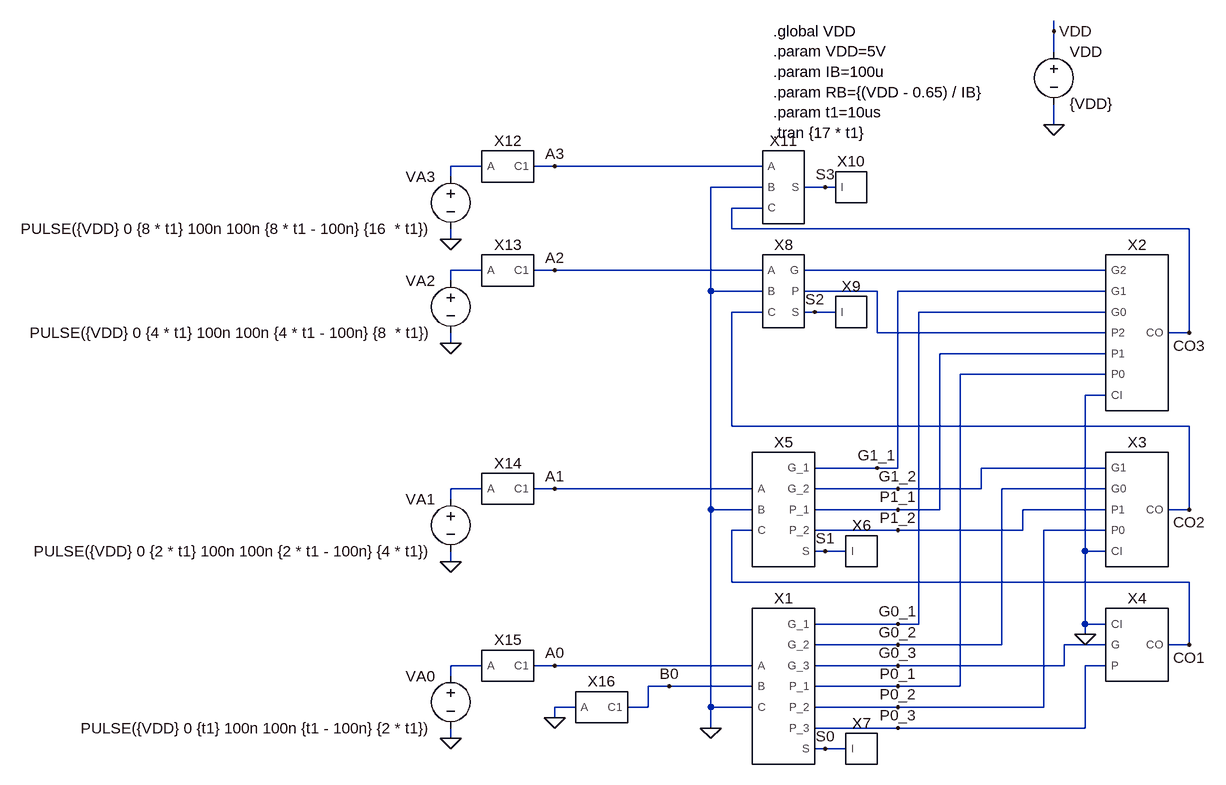
[diagram p0: schematic tb_count4.asc]
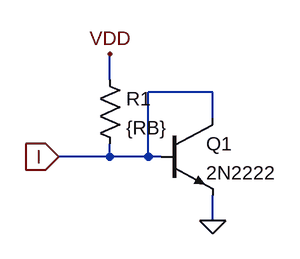
[diagram p1: sub-circuit iilout.asc]
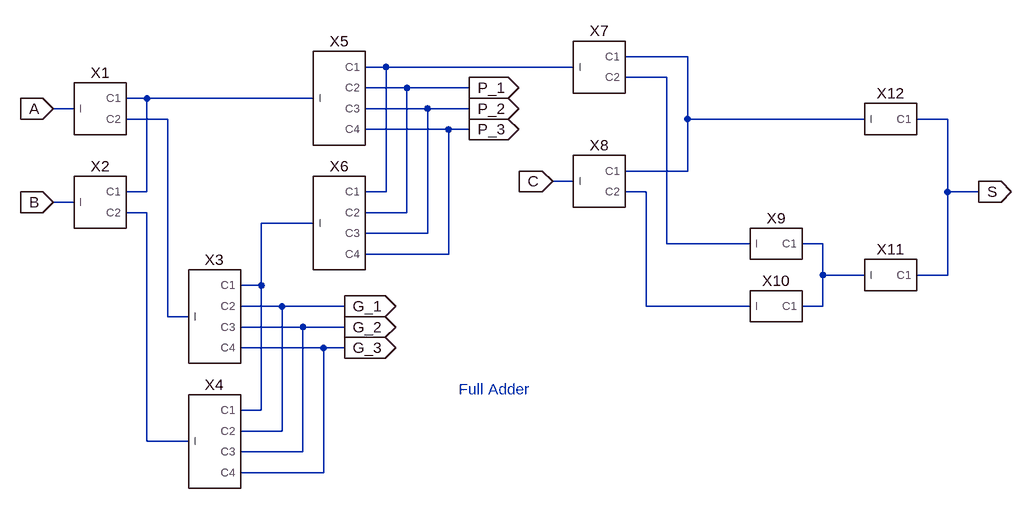
[diagram p2: sub-circuit fag3p3.asc]
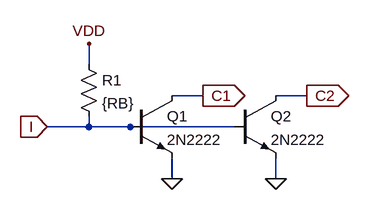
[diagram p3: sub-circuit iilg2.asc]
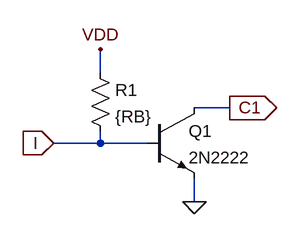
[diagram p4: sub-circuit iilg1.asc]
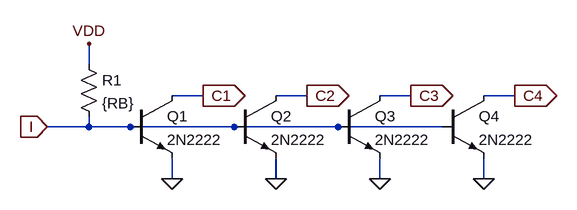
[diagram p5: sub-circuit iilg4.asc]
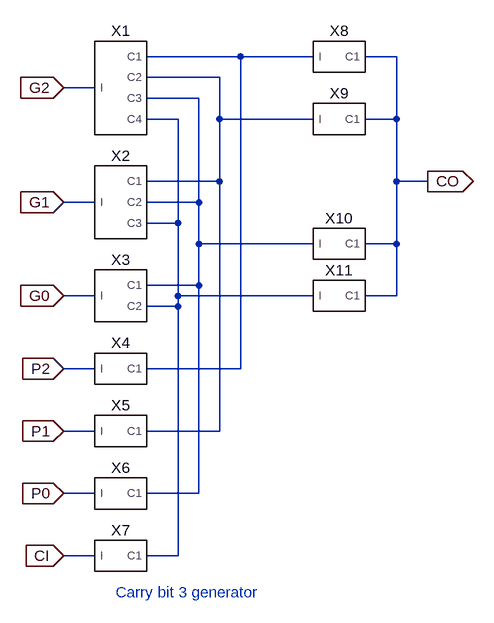
[diagram p6: sub-circuit cla3.asc]
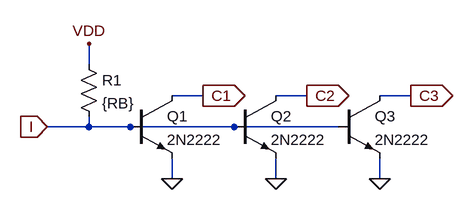
[diagram p7: sub-circuit iilg3.asc]
tb_count4.asc, the LTspice schematic file:
Version 4
SHEET 1 4164 944
WIRE 384 -912 384 -928
WIRE 384 -880 384 -912
WIRE 384 -768 384 -800
WIRE -496 -704 -544 -704
WIRE -384 -704 -416 -704
WIRE -64 -704 -384 -704
WIRE -544 -688 -544 -704
WIRE -64 -672 -144 -672
WIRE 32 -672 0 -672
WIRE 48 -672 32 -672
WIRE -64 -640 -112 -640
WIRE -112 -608 -112 -640
WIRE 592 -608 -112 -608
WIRE -544 -592 -544 -608
WIRE -496 -544 -544 -544
WIRE -384 -544 -416 -544
WIRE -64 -544 -384 -544
WIRE 464 -544 0 -544
WIRE -544 -528 -544 -544
WIRE -144 -512 -144 -672
WIRE -64 -512 -144 -512
WIRE 112 -512 0 -512
WIRE 464 -512 144 -512
WIRE -64 -480 -112 -480
WIRE 16 -480 0 -480
WIRE 48 -480 16 -480
WIRE 464 -480 176 -480
WIRE 112 -448 112 -512
WIRE 464 -448 112 -448
WIRE 592 -448 592 -608
WIRE 592 -448 560 -448
WIRE -544 -432 -544 -448
WIRE 464 -416 208 -416
WIRE 464 -384 240 -384
WIRE 464 -352 432 -352
WIRE -112 -304 -112 -480
WIRE 592 -304 -112 -304
WIRE 112 -240 16 -240
WIRE 144 -240 144 -512
WIRE 144 -240 112 -240
WIRE 464 -240 272 -240
WIRE -496 -208 -544 -208
WIRE -384 -208 -416 -208
WIRE -80 -208 -384 -208
WIRE 144 -208 16 -208
WIRE 272 -208 272 -240
WIRE 272 -208 144 -208
WIRE 464 -208 304 -208
WIRE -544 -192 -544 -208
WIRE -144 -176 -144 -512
WIRE -80 -176 -144 -176
WIRE 144 -176 16 -176
WIRE 208 -176 208 -416
WIRE 208 -176 144 -176
WIRE 464 -176 336 -176
WIRE 592 -176 592 -304
WIRE 592 -176 560 -176
WIRE -80 -144 -112 -144
WIRE 144 -144 16 -144
WIRE 336 -144 336 -176
WIRE 336 -144 144 -144
WIRE 464 -144 368 -144
WIRE 32 -112 16 -112
WIRE 64 -112 32 -112
WIRE 432 -112 432 -352
WIRE 464 -112 432 -112
WIRE -544 -96 -544 -112
WIRE -112 -64 -112 -144
WIRE 592 -64 -112 -64
WIRE 144 0 16 0
WIRE 176 0 176 -480
WIRE 176 0 144 0
WIRE 432 0 432 -112
WIRE 464 0 432 0
WIRE 432 16 432 0
WIRE 144 32 16 32
WIRE 304 32 304 -208
WIRE 304 32 144 32
WIRE 464 32 400 32
WIRE 592 32 592 -64
WIRE 592 32 560 32
WIRE -496 64 -544 64
WIRE -384 64 -416 64
WIRE -80 64 -384 64
WIRE 144 64 16 64
WIRE 400 64 400 32
WIRE 400 64 144 64
WIRE 464 64 432 64
WIRE -544 80 -544 64
WIRE -208 96 -240 96
WIRE -80 96 -208 96
WIRE 144 96 16 96
WIRE 240 96 240 -384
WIRE 240 96 144 96
WIRE -352 128 -384 128
WIRE -240 128 -240 96
WIRE -240 128 -272 128
WIRE -144 128 -144 -176
WIRE -80 128 -144 128
WIRE 144 128 16 128
WIRE 368 128 368 -144
WIRE 368 128 144 128
WIRE -384 144 -384 128
WIRE -144 160 -144 128
WIRE 144 160 16 160
WIRE 432 160 432 64
WIRE 432 160 144 160
WIRE -544 176 -544 160
WIRE 32 192 16 192
WIRE 64 192 32 192
FLAG 384 -768 0
FLAG 384 -912 VDD
FLAG -544 176 0
FLAG -544 -96 0
FLAG -544 -432 0
FLAG 432 16 0
FLAG -144 160 0
FLAG 32 192 S0
FLAG 32 -112 S1
FLAG 16 -480 S2
FLAG 592 32 CO1
FLAG 592 -176 CO2
FLAG 32 -672 S3
FLAG 592 -448 CO3
FLAG -544 -592 0
FLAG -384 -704 A3
FLAG -384 -544 A2
FLAG -384 -208 A1
FLAG -384 64 A0
FLAG 144 96 P0_1
FLAG 144 128 P0_2
FLAG 144 160 P0_3
FLAG 144 64 G0_3
FLAG 144 32 G0_2
FLAG 144 0 G0_1
FLAG 112 -240 G1_1
FLAG 144 -208 G1_2
FLAG 144 -176 P1_1
FLAG 144 -144 P1_2
FLAG -208 96 B0
FLAG -384 144 0
SYMBOL voltage 384 -896 R0
SYMATTR InstName VDD
SYMATTR Value {VDD}
SYMBOL voltage -544 64 M0
SYMATTR InstName VA0
SYMATTR Value PULSE({VDD} 0 {t1} 100n 100n {t1 - 100n} {2 * t1})
SYMBOL voltage -544 -208 M0
SYMATTR InstName VA1
SYMATTR Value PULSE({VDD} 0 {2 * t1} 100n 100n {2 * t1 - 100n} {4 * t1})
SYMBOL voltage -544 -544 M0
SYMATTR InstName VA2
SYMATTR Value PULSE({VDD} 0 {4 * t1} 100n 100n {4 * t1 - 100n} {8  * t1})
SYMBOL iilout 80 -112 R0
SYMATTR InstName X6
SYMBOL iilout 80 192 R0
SYMATTR InstName X7
SYMBOL fag3p3 -32 96 R0
SYMATTR InstName X1
SYMBOL cla3 512 -448 R0
SYMATTR InstName X2
SYMBOL cla2 512 -176 R0
SYMATTR InstName X3
SYMBOL cla1 512 32 R0
SYMATTR InstName X4
SYMBOL fag2p2 -32 -176 R0
SYMATTR InstName X5
SYMBOL fag1p1 -32 -512 R0
SYMATTR InstName X8
SYMBOL iilout 64 -480 R0
SYMATTR InstName X9
SYMBOL iilout 64 -672 R0
SYMATTR InstName X10
SYMBOL fag0p0 -32 -672 R0
SYMATTR InstName X11
SYMBOL voltage -544 -704 M0
SYMATTR InstName VA3
SYMATTR Value PULSE({VDD} 0 {8 * t1} 100n 100n {8 * t1 - 100n} {16  * t1})
SYMBOL iilin1 -464 -704 R0
SYMATTR InstName X12
SYMBOL iilin1 -464 -544 R0
SYMATTR InstName X13
SYMBOL iilin1 -464 -208 R0
SYMATTR InstName X14
SYMBOL iilin1 -464 64 R0
SYMATTR InstName X15
SYMBOL iilin1 -320 128 R0
SYMATTR InstName X16
TEXT -48 -912 Left 2 !.global VDD\n.param VDD=5V\n.param IB=100u\n.param RB={(VDD - 0.65) / IB}\n.param t1=10us\n.tran {17 * t1}

iilout.asc, the sub-circuit schematic file:
Version 4
SHEET 1 880 680
WIRE 48 208 48 176
WIRE 176 224 96 224
WIRE 176 256 176 224
WIRE 48 304 48 288
WIRE 48 304 -16 304
WIRE 96 304 96 224
WIRE 96 304 48 304
WIRE 112 304 96 304
WIRE 176 384 176 352
FLAG 176 384 0
FLAG 48 176 VDD
FLAG -16 304 I
IOPIN -16 304 In
SYMBOL npn 112 256 R0
SYMATTR InstName Q1
SYMATTR Value 2N2222
SYMBOL res 32 192 R0
SYMATTR InstName R1
SYMATTR Value {RB}

fag3p3.asc, the sub-circuit schematic file:
Version 4
SHEET 1 4164 944
WIRE 1264 -320 1168 -320
WIRE 800 -304 768 -304
WIRE 1088 -304 800 -304
WIRE 1232 -288 1168 -288
WIRE 832 -272 768 -272
WIRE 928 -272 832 -272
WIRE 432 -256 400 -256
WIRE 688 -256 432 -256
WIRE 320 -240 288 -240
WIRE 864 -240 768 -240
WIRE 928 -240 864 -240
WIRE 464 -224 400 -224
WIRE 1264 -224 1264 -320
WIRE 1536 -224 1264 -224
WIRE 1664 -224 1616 -224
WIRE 896 -208 768 -208
WIRE 928 -208 896 -208
WIRE 1264 -144 1264 -224
WIRE 1264 -144 1168 -144
WIRE 1088 -128 1056 -128
WIRE 432 -112 432 -256
WIRE 432 -112 400 -112
WIRE 800 -112 800 -304
WIRE 800 -112 768 -112
WIRE 1200 -112 1168 -112
WIRE 1664 -112 1664 -224
WIRE 1712 -112 1664 -112
WIRE 320 -96 288 -96
WIRE 432 -80 400 -80
WIRE 832 -80 832 -272
WIRE 832 -80 768 -80
WIRE 688 -64 608 -64
WIRE 864 -48 864 -240
WIRE 864 -48 768 -48
WIRE 1232 -32 1232 -288
WIRE 1360 -32 1232 -32
WIRE 1472 -32 1440 -32
WIRE 896 -16 896 -208
WIRE 896 -16 768 -16
WIRE 1472 16 1472 -32
WIRE 1536 16 1472 16
WIRE 1664 16 1664 -112
WIRE 1664 16 1616 16
WIRE 608 32 608 -64
WIRE 608 32 576 32
WIRE 640 64 576 64
WIRE 736 64 640 64
WIRE 1200 64 1200 -112
WIRE 1360 64 1200 64
WIRE 1472 64 1472 16
WIRE 1472 64 1440 64
WIRE 464 80 464 -224
WIRE 496 80 464 80
WIRE 672 96 576 96
WIRE 736 96 672 96
WIRE 704 128 576 128
WIRE 736 128 704 128
WIRE 608 224 608 32
WIRE 608 224 576 224
WIRE 640 256 640 64
WIRE 640 256 576 256
WIRE 432 272 432 -80
WIRE 496 272 432 272
WIRE 672 288 672 96
WIRE 672 288 576 288
WIRE 704 320 704 128
WIRE 704 320 576 320
FLAG 288 -240 A
IOPIN 288 -240 In
FLAG 288 -96 B
IOPIN 288 -96 In
FLAG 1056 -128 C
IOPIN 1056 -128 In
FLAG 736 64 G_1
IOPIN 736 64 Out
FLAG 928 -272 P_1
IOPIN 928 -272 Out
FLAG 1712 -112 S
IOPIN 1712 -112 Out
FLAG 736 96 G_2
IOPIN 736 96 Out
FLAG 928 -240 P_2
IOPIN 928 -240 Out
FLAG 736 128 G_3
IOPIN 736 128 Out
FLAG 928 -208 P_3
IOPIN 928 -208 Out
SYMBOL iilg2 352 -240 R0
SYMATTR InstName X1
SYMBOL iilg2 352 -96 R0
SYMATTR InstName X2
SYMBOL iilg2 1120 -304 R0
SYMATTR InstName X7
SYMBOL iilg1 1392 -32 R0
SYMATTR InstName X9
SYMBOL iilg1 1392 64 R0
SYMATTR InstName X10
SYMBOL iilg1 1568 16 R0
SYMATTR InstName X11
SYMBOL iilg1 1568 -224 R0
SYMATTR InstName X12
SYMBOL iilg2 1120 -128 R0
SYMATTR InstName X8
SYMBOL iilg4 528 80 R0
SYMATTR InstName X3
SYMBOL iilg4 528 272 R0
SYMATTR InstName X4
SYMBOL iilg4 720 -256 R0
SYMATTR InstName X5
SYMBOL iilg4 720 -64 R0
SYMATTR InstName X6
TEXT 912 192 Left 2 ;Full Adder

iilg2.asc, the sub-circuit schematic file:
Version 4
SHEET 1 880 680
WIRE 384 240 384 208
WIRE 560 288 512 288
WIRE 720 288 672 288
WIRE 384 336 384 320
WIRE 384 336 320 336
WIRE 448 336 384 336
WIRE 608 336 448 336
WIRE 512 416 512 384
WIRE 672 416 672 384
FLAG 384 208 VDD
FLAG 320 336 I
IOPIN 320 336 In
FLAG 512 416 0
FLAG 560 288 C1
IOPIN 560 288 Out
FLAG 672 416 0
FLAG 720 288 C2
IOPIN 720 288 Out
SYMBOL npn 448 288 R0
SYMATTR InstName Q1
SYMATTR Value 2N2222
SYMBOL res 368 224 R0
SYMATTR InstName R1
SYMATTR Value {RB}
SYMBOL npn 608 288 R0
SYMATTR InstName Q2
SYMATTR Value 2N2222

iilg1.asc, the sub-circuit schematic file:
Version 4
SHEET 1 880 680
WIRE 384 240 384 208
WIRE 560 288 512 288
WIRE 384 336 384 320
WIRE 384 336 320 336
WIRE 448 336 384 336
WIRE 512 416 512 384
FLAG 512 416 0
FLAG 384 208 VDD
FLAG 320 336 I
IOPIN 320 336 In
FLAG 560 288 C1
IOPIN 560 288 Out
SYMBOL npn 448 288 R0
SYMATTR InstName Q1
SYMATTR Value 2N2222
SYMBOL res 368 224 R0
SYMATTR InstName R1
SYMATTR Value {RB}

iilg4.asc, the sub-circuit schematic file:
Version 4
SHEET 1 1132 680
WIRE 384 240 384 208
WIRE 560 288 512 288
WIRE 720 288 672 288
WIRE 880 288 832 288
WIRE 1040 288 992 288
WIRE 384 336 384 320
WIRE 384 336 320 336
WIRE 448 336 384 336
WIRE 608 336 448 336
WIRE 768 336 608 336
WIRE 928 336 768 336
WIRE 512 416 512 384
WIRE 672 416 672 384
WIRE 832 416 832 384
WIRE 992 416 992 384
FLAG 384 208 VDD
FLAG 320 336 I
IOPIN 320 336 In
FLAG 512 416 0
FLAG 560 288 C1
IOPIN 560 288 Out
FLAG 672 416 0
FLAG 720 288 C2
IOPIN 720 288 Out
FLAG 832 416 0
FLAG 880 288 C3
IOPIN 880 288 Out
FLAG 992 416 0
FLAG 1040 288 C4
IOPIN 1040 288 Out
SYMBOL npn 448 288 R0
SYMATTR InstName Q1
SYMATTR Value 2N2222
SYMBOL res 368 224 R0
SYMATTR InstName R1
SYMATTR Value {RB}
SYMBOL npn 608 288 R0
SYMATTR InstName Q2
SYMATTR Value 2N2222
SYMBOL npn 768 288 R0
SYMATTR InstName Q3
SYMATTR Value 2N2222
SYMBOL npn 928 288 R0
SYMATTR InstName Q4
SYMATTR Value 2N2222

cla3.asc, the sub-circuit schematic file:
Version 4
SHEET 1 1200 840
WIRE 432 0 288 0
WIRE 544 0 432 0
WIRE 672 0 624 0
WIRE 400 32 288 32
WIRE 208 48 160 48
WIRE 368 64 288 64
WIRE 336 96 288 96
WIRE 400 96 400 32
WIRE 544 96 400 96
WIRE 672 96 672 0
WIRE 672 96 624 96
WIRE 400 192 400 96
WIRE 400 192 288 192
WIRE 672 192 672 96
WIRE 720 192 672 192
WIRE 208 224 160 224
WIRE 368 224 368 64
WIRE 368 224 288 224
WIRE 336 256 336 96
WIRE 336 256 288 256
WIRE 368 288 368 224
WIRE 544 288 368 288
WIRE 672 288 672 192
WIRE 672 288 624 288
WIRE 368 352 368 288
WIRE 368 352 288 352
WIRE 208 368 160 368
WIRE 336 368 336 256
WIRE 544 368 336 368
WIRE 672 368 672 288
WIRE 672 368 624 368
WIRE 336 384 336 368
WIRE 336 384 288 384
WIRE 208 480 160 480
WIRE 432 480 432 0
WIRE 432 480 288 480
WIRE 208 576 160 576
WIRE 400 576 400 192
WIRE 400 576 288 576
WIRE 208 672 160 672
WIRE 368 672 368 352
WIRE 368 672 288 672
WIRE 208 768 160 768
WIRE 336 768 336 384
WIRE 336 768 288 768
FLAG 160 48 G2
IOPIN 160 48 In
FLAG 160 224 G1
IOPIN 160 224 In
FLAG 160 368 G0
IOPIN 160 368 In
FLAG 160 480 P2
IOPIN 160 480 In
FLAG 160 576 P1
IOPIN 160 576 In
FLAG 160 672 P0
IOPIN 160 672 In
FLAG 160 768 CI
IOPIN 160 768 In
FLAG 720 192 CO
IOPIN 720 192 Out
SYMBOL iilg4 240 48 R0
SYMATTR InstName X1
SYMBOL iilg3 240 224 R0
SYMATTR InstName X2
SYMBOL iilg2 240 368 R0
SYMATTR InstName X3
SYMBOL iilg1 240 480 R0
SYMATTR InstName X4
SYMBOL iilg1 240 576 R0
SYMATTR InstName X5
SYMBOL iilg1 240 672 R0
SYMATTR InstName X6
SYMBOL iilg1 240 768 R0
SYMATTR InstName X7
SYMBOL iilg1 576 0 R0
SYMATTR InstName X8
SYMBOL iilg1 576 96 R0
SYMATTR InstName X9
SYMBOL iilg1 576 288 R0
SYMATTR InstName X10
SYMBOL iilg1 576 368 R0
SYMATTR InstName X11
TEXT 240 824 Left 2 ;Carry bit 3 generator

iilg3.asc, the sub-circuit schematic file:
Version 4
SHEET 1 956 680
WIRE 384 240 384 208
WIRE 560 288 512 288
WIRE 720 288 672 288
WIRE 880 288 832 288
WIRE 384 336 384 320
WIRE 384 336 320 336
WIRE 448 336 384 336
WIRE 608 336 448 336
WIRE 768 336 608 336
WIRE 512 416 512 384
WIRE 672 416 672 384
WIRE 832 416 832 384
FLAG 384 208 VDD
FLAG 320 336 I
IOPIN 320 336 In
FLAG 512 416 0
FLAG 560 288 C1
IOPIN 560 288 Out
FLAG 672 416 0
FLAG 720 288 C2
IOPIN 720 288 Out
FLAG 832 416 0
FLAG 880 288 C3
IOPIN 880 288 Out
SYMBOL npn 448 288 R0
SYMATTR InstName Q1
SYMATTR Value 2N2222
SYMBOL res 368 224 R0
SYMATTR InstName R1
SYMATTR Value {RB}
SYMBOL npn 608 288 R0
SYMATTR InstName Q2
SYMATTR Value 2N2222
SYMBOL npn 768 288 R0
SYMATTR InstName Q3
SYMATTR Value 2N2222

cla2.asc, the sub-circuit schematic file:
Version 4
SHEET 1 1856 1728
WIRE 464 -208 352 -208
WIRE 576 -208 464 -208
WIRE 704 -208 656 -208
WIRE 272 -176 208 -176
WIRE 432 -176 352 -176
WIRE 400 -144 352 -144
WIRE 432 -64 432 -176
WIRE 576 -64 432 -64
WIRE 704 -64 704 -208
WIRE 704 -64 656 -64
WIRE 752 -64 704 -64
WIRE 432 -48 432 -64
WIRE 432 -48 352 -48
WIRE 272 -32 208 -32
WIRE 464 -16 464 -208
WIRE 464 -16 352 -16
WIRE 272 80 208 80
WIRE 400 80 400 -144
WIRE 400 80 352 80
WIRE 576 80 400 80
WIRE 704 80 704 -64
WIRE 704 80 656 80
WIRE 272 176 208 176
WIRE 432 176 432 -48
WIRE 432 176 352 176
WIRE 272 272 208 272
WIRE 464 272 464 -16
WIRE 464 272 352 272
FLAG 208 272 CI
IOPIN 208 272 In
FLAG 208 -176 G1
IOPIN 208 -176 In
FLAG 208 176 P0
IOPIN 208 176 In
FLAG 752 -64 CO
IOPIN 752 -64 Out
FLAG 208 -32 G0
IOPIN 208 -32 In
FLAG 208 80 P1
IOPIN 208 80 In
SYMBOL iilg3 304 -176 R0
SYMATTR InstName X1
SYMBOL iilg2 304 -32 R0
SYMATTR InstName X2
SYMBOL iilg1 304 80 R0
SYMATTR InstName X3
SYMBOL iilg1 304 176 R0
SYMATTR InstName X4
SYMBOL iilg1 304 272 R0
SYMATTR InstName X5
SYMBOL iilg1 608 -208 R0
SYMATTR InstName X6
SYMBOL iilg1 608 -64 R0
SYMATTR InstName X7
SYMBOL iilg1 608 80 R0
SYMATTR InstName X8
TEXT 512 280 Left 2 ;Carry bit 2 generator

cla1.asc, the sub-circuit schematic file:
Version 4
SHEET 1 1856 1728
WIRE 336 192 208 192
WIRE 464 192 416 192
WIRE 464 256 464 192
WIRE 544 256 464 256
WIRE 688 256 624 256
WIRE 464 320 464 256
WIRE 464 320 416 320
WIRE 336 336 208 336
WIRE 688 336 688 256
WIRE 736 336 688 336
WIRE 464 352 416 352
WIRE 464 416 464 352
WIRE 544 416 464 416
WIRE 688 416 688 336
WIRE 688 416 624 416
WIRE 336 480 208 480
WIRE 464 480 464 416
WIRE 464 480 416 480
FLAG 208 192 CI
IOPIN 208 192 In
FLAG 208 336 G
IOPIN 208 336 In
FLAG 208 480 P
IOPIN 208 480 In
FLAG 736 336 CO
IOPIN 736 336 Out
SYMBOL iilg1 368 192 R0
SYMATTR InstName X1
SYMBOL iilg1 368 480 R0
SYMATTR InstName X2
SYMBOL iilg2 368 336 R0
SYMATTR InstName X3
SYMBOL iilg1 576 256 R0
SYMATTR InstName X4
SYMBOL iilg1 576 416 R0
SYMATTR InstName X5
TEXT 336 528 Left 2 ;Carry bit 1 generator

fag2p2.asc, the sub-circuit schematic file:
Version 4
SHEET 1 4164 944
WIRE 1264 -304 1168 -304
WIRE 800 -288 768 -288
WIRE 1088 -288 800 -288
WIRE 1232 -272 1168 -272
WIRE 432 -256 400 -256
WIRE 688 -256 432 -256
WIRE 832 -256 768 -256
WIRE 896 -256 832 -256
WIRE 320 -240 288 -240
WIRE 464 -224 400 -224
WIRE 864 -224 768 -224
WIRE 896 -224 864 -224
WIRE 1264 -208 1264 -304
WIRE 1536 -208 1264 -208
WIRE 1664 -208 1616 -208
WIRE 800 -128 800 -288
WIRE 800 -128 768 -128
WIRE 1264 -128 1264 -208
WIRE 1264 -128 1168 -128
WIRE 432 -112 432 -256
WIRE 432 -112 400 -112
WIRE 1088 -112 1056 -112
WIRE 320 -96 288 -96
WIRE 688 -96 608 -96
WIRE 832 -96 832 -256
WIRE 832 -96 768 -96
WIRE 1200 -96 1168 -96
WIRE 1664 -96 1664 -208
WIRE 1712 -96 1664 -96
WIRE 432 -80 400 -80
WIRE 864 -64 864 -224
WIRE 864 -64 768 -64
WIRE 1232 -16 1232 -272
WIRE 1360 -16 1232 -16
WIRE 1472 -16 1440 -16
WIRE 608 0 608 -96
WIRE 608 0 576 0
WIRE 464 32 464 -224
WIRE 496 32 464 32
WIRE 640 32 576 32
WIRE 704 32 640 32
WIRE 1472 32 1472 -16
WIRE 1536 32 1472 32
WIRE 1664 32 1664 -96
WIRE 1664 32 1616 32
WIRE 672 64 576 64
WIRE 704 64 672 64
WIRE 1200 80 1200 -96
WIRE 1360 80 1200 80
WIRE 1472 80 1472 32
WIRE 1472 80 1440 80
WIRE 608 160 608 0
WIRE 608 160 576 160
WIRE 432 192 432 -80
WIRE 496 192 432 192
WIRE 640 192 640 32
WIRE 640 192 576 192
WIRE 672 224 672 64
WIRE 672 224 576 224
FLAG 288 -240 A
IOPIN 288 -240 In
FLAG 288 -96 B
IOPIN 288 -96 In
FLAG 1056 -112 C
IOPIN 1056 -112 In
FLAG 704 32 G_1
IOPIN 704 32 Out
FLAG 896 -256 P_1
IOPIN 896 -256 Out
FLAG 1712 -96 S
IOPIN 1712 -96 Out
FLAG 704 64 G_2
IOPIN 704 64 Out
FLAG 896 -224 P_2
IOPIN 896 -224 Out
SYMBOL iilg2 352 -240 R0
SYMATTR InstName X1
SYMBOL iilg2 352 -96 R0
SYMATTR InstName X2
SYMBOL iilg2 1120 -288 R0
SYMATTR InstName X7
SYMBOL iilg1 1392 -16 R0
SYMATTR InstName X9
SYMBOL iilg1 1392 80 R0
SYMATTR InstName X10
SYMBOL iilg1 1568 32 R0
SYMATTR InstName X11
SYMBOL iilg1 1568 -208 R0
SYMATTR InstName X12
SYMBOL iilg2 1120 -112 R0
SYMATTR InstName X8
SYMBOL iilg3 528 32 R0
SYMATTR InstName X3
SYMBOL iilg3 528 192 R0
SYMATTR InstName X4
SYMBOL iilg3 720 -256 R0
SYMATTR InstName X5
SYMBOL iilg3 720 -96 R0
SYMATTR InstName X6
TEXT 912 192 Left 2 ;Full Adder

fag1p1.asc, the sub-circuit schematic file:
Version 4
SHEET 1 4164 944
WIRE 1264 -288 1168 -288
WIRE 848 -272 768 -272
WIRE 1088 -272 848 -272
WIRE 432 -256 400 -256
WIRE 688 -256 432 -256
WIRE 1232 -256 1168 -256
WIRE 320 -240 288 -240
WIRE 816 -240 768 -240
WIRE 464 -224 400 -224
WIRE 1264 -192 1264 -288
WIRE 1536 -192 1264 -192
WIRE 1664 -192 1616 -192
WIRE 848 -144 848 -272
WIRE 848 -144 768 -144
WIRE 688 -128 656 -128
WIRE 432 -112 432 -256
WIRE 432 -112 400 -112
WIRE 816 -112 816 -240
WIRE 816 -112 768 -112
WIRE 880 -112 816 -112
WIRE 1264 -112 1264 -192
WIRE 1264 -112 1168 -112
WIRE 320 -96 288 -96
WIRE 1088 -96 1056 -96
WIRE 432 -80 400 -80
WIRE 1200 -80 1168 -80
WIRE 1664 -80 1664 -192
WIRE 1712 -80 1664 -80
WIRE 1232 0 1232 -256
WIRE 1360 0 1232 0
WIRE 1472 0 1440 0
WIRE 656 16 656 -128
WIRE 656 16 576 16
WIRE 464 32 464 -224
WIRE 496 32 464 32
WIRE 608 48 576 48
WIRE 1472 48 1472 0
WIRE 1536 48 1472 48
WIRE 1664 48 1664 -80
WIRE 1664 48 1616 48
WIRE 1200 96 1200 -80
WIRE 1360 96 1200 96
WIRE 1472 96 1472 48
WIRE 1472 96 1440 96
WIRE 656 144 656 16
WIRE 656 144 576 144
WIRE 432 160 432 -80
WIRE 496 160 432 160
WIRE 608 176 608 48
WIRE 608 176 576 176
WIRE 656 176 608 176
FLAG 288 -240 A
IOPIN 288 -240 In
FLAG 288 -96 B
IOPIN 288 -96 In
FLAG 1056 -96 C
IOPIN 1056 -96 In
FLAG 656 176 G
IOPIN 656 176 Out
FLAG 880 -112 P
IOPIN 880 -112 Out
FLAG 1712 -80 S
IOPIN 1712 -80 Out
SYMBOL iilg2 352 -240 R0
SYMATTR InstName X1
SYMBOL iilg2 352 -96 R0
SYMATTR InstName X2
SYMBOL iilg2 528 32 R0
SYMATTR InstName X3
SYMBOL iilg2 528 160 R0
SYMATTR InstName X4
SYMBOL iilg2 720 -256 R0
SYMATTR InstName X5
SYMBOL iilg2 720 -128 R0
SYMATTR InstName X6
SYMBOL iilg2 1120 -272 R0
SYMATTR InstName X7
SYMBOL iilg1 1392 0 R0
SYMATTR InstName X9
SYMBOL iilg1 1392 96 R0
SYMATTR InstName X10
SYMBOL iilg1 1568 48 R0
SYMATTR InstName X11
SYMBOL iilg1 1568 -192 R0
SYMATTR InstName X12
SYMBOL iilg2 1120 -96 R0
SYMATTR InstName X8
TEXT 912 192 Left 2 ;Full Adder

fag0p0.asc, the sub-circuit schematic file:
Version 4
SHEET 1 4164 944
WIRE 1104 -272 1008 -272
WIRE 432 -256 400 -256
WIRE 688 -256 432 -256
WIRE 800 -256 768 -256
WIRE 928 -256 800 -256
WIRE 320 -240 288 -240
WIRE 1072 -240 1008 -240
WIRE 464 -224 400 -224
WIRE 1104 -176 1104 -272
WIRE 1376 -176 1104 -176
WIRE 1504 -176 1456 -176
WIRE 688 -160 608 -160
WIRE 800 -160 800 -256
WIRE 800 -160 768 -160
WIRE 432 -112 432 -256
WIRE 432 -112 400 -112
WIRE 320 -96 288 -96
WIRE 1104 -96 1104 -176
WIRE 1104 -96 1008 -96
WIRE 432 -80 400 -80
WIRE 928 -80 896 -80
WIRE 1040 -64 1008 -64
WIRE 1504 -64 1504 -176
WIRE 1552 -64 1504 -64
WIRE 1072 16 1072 -240
WIRE 1200 16 1072 16
WIRE 1312 16 1280 16
WIRE 464 32 464 -224
WIRE 496 32 464 32
WIRE 608 32 608 -160
WIRE 608 32 576 32
WIRE 1312 64 1312 16
WIRE 1376 64 1312 64
WIRE 1504 64 1504 -64
WIRE 1504 64 1456 64
WIRE 1040 112 1040 -64
WIRE 1200 112 1040 112
WIRE 1312 112 1312 64
WIRE 1312 112 1280 112
WIRE 432 160 432 -80
WIRE 496 160 432 160
WIRE 608 160 608 32
WIRE 608 160 576 160
FLAG 288 -240 A
IOPIN 288 -240 In
FLAG 288 -96 B
IOPIN 288 -96 In
FLAG 896 -80 C
IOPIN 896 -80 In
FLAG 1552 -64 S
IOPIN 1552 -64 Out
SYMBOL iilg2 352 -240 R0
SYMATTR InstName X1
SYMBOL iilg2 352 -96 R0
SYMATTR InstName X2
SYMBOL iilg2 960 -256 R0
SYMATTR InstName X7
SYMBOL iilg1 1232 16 R0
SYMATTR InstName X9
SYMBOL iilg1 1232 112 R0
SYMATTR InstName X10
SYMBOL iilg1 1408 64 R0
SYMATTR InstName X11
SYMBOL iilg1 1408 -176 R0
SYMATTR InstName X12
SYMBOL iilg2 960 -80 R0
SYMATTR InstName X8
SYMBOL iilg1 528 32 R0
SYMATTR InstName X3
SYMBOL iilg1 528 160 R0
SYMATTR InstName X4
SYMBOL iilg1 720 -256 R0
SYMATTR InstName X5
SYMBOL iilg1 720 -160 R0
SYMATTR InstName X6
TEXT 912 192 Left 2 ;Full Adder

iilin1.asc, the sub-circuit schematic file:
Version 4
SHEET 1 880 680
WIRE 240 192 192 192
WIRE 32 240 0 240
WIRE 128 240 112 240
WIRE 192 352 192 288
FLAG 192 352 0
FLAG 240 192 C1
IOPIN 240 192 Out
FLAG 0 240 A
IOPIN 0 240 In
SYMBOL npn 128 192 R0
SYMATTR InstName Q1
SYMATTR Value 2N2222
SYMBOL res 16 256 R270
WINDOW 0 32 56 VTop 2
WINDOW 3 0 56 VBottom 2
SYMATTR InstName R1
SYMATTR Value {RB}

The netlist it stands for:
* tb_count4.asc
VDD VDD 0 {VDD}
VA0 N006 0 PULSE({VDD} 0 {t1} 100n 100n {t1 - 100n} {2 * t1})
VA1 N005 0 PULSE({VDD} 0 {2 * t1} 100n 100n {2 * t1 - 100n} {4 * t1})
VA2 N002 0 PULSE({VDD} 0 {4 * t1} 100n 100n {4 * t1 - 100n} {8  * t1})
XX6 S1 iilout
XX7 S0 iilout
XX1 A0 B0 0 G0_1 G0_2 G0_3 P0_1 P0_2 P0_3 S0 fag3p3
XX2 N003 G1_1 G0_1 N004 P1_1 P0_1 0 CO3 cla3
XX3 G1_2 G0_2 P1_2 P0_2 0 CO2 cla2
XX4 0 G0_3 P0_3 CO1 cla1
XX5 A1 0 CO1 G1_1 G1_2 P1_1 P1_2 S1 fag2p2
XX8 A2 0 CO2 N003 N004 S2 fag1p1
XX9 S2 iilout
XX10 S3 iilout
XX11 A3 0 CO3 S3 fag0p0
VA3 N001 0 PULSE({VDD} 0 {8 * t1} 100n 100n {8 * t1 - 100n} {16  * t1})
XX12 N001 A3 iilin1
XX13 N002 A2 iilin1
XX14 N005 A1 iilin1
XX15 N006 A0 iilin1
XX16 0 B0 iilin1

* block symbol definitions
.subckt iilout I
Q1 I I 0 0 2N2222
R1 VDD I {RB}
.ends iilout

.subckt fag3p3 A B C G_1 G_2 G_3 P_1 P_2 P_3 S
XX1 A N004 N005 iilg2
XX2 B N004 N007 iilg2
XX7 N002 N001 N003 iilg2
XX9 N003 N009 iilg1
XX10 N006 N009 iilg1
XX11 N009 S iilg1
XX12 N001 S iilg1
XX8 C N001 N006 iilg2
XX3 N005 N008 G_1 G_2 G_3 iilg4
XX4 N007 N008 G_1 G_2 G_3 iilg4
XX5 N004 N002 P_1 P_2 P_3 iilg4
XX6 N008 N002 P_1 P_2 P_3 iilg4
* Full Adder
.ends fag3p3

.subckt iilg2 I C1 C2
Q1 C1 I 0 0 2N2222
R1 VDD I {RB}
Q2 C2 I 0 0 2N2222
.ends iilg2

.subckt iilg1 I C1
Q1 C1 I 0 0 2N2222
R1 VDD I {RB}
.ends iilg1

.subckt iilg4 I C1 C2 C3 C4
Q1 C1 I 0 0 2N2222
R1 VDD I {RB}
Q2 C2 I 0 0 2N2222
Q3 C3 I 0 0 2N2222
Q4 C4 I 0 0 2N2222
.ends iilg4

.subckt cla3 G2 G1 G0 P2 P1 P0 CI CO
XX1 G2 N001 N002 N003 N004 iilg4
XX2 G1 N002 N003 N004 iilg3
XX3 G0 N003 N004 iilg2
XX4 P2 N001 iilg1
XX5 P1 N002 iilg1
XX6 P0 N003 iilg1
XX7 CI N004 iilg1
XX8 N001 CO iilg1
XX9 N002 CO iilg1
XX10 N003 CO iilg1
XX11 N004 CO iilg1
* Carry bit 3 generator
.ends cla3

.subckt iilg3 I C1 C2 C3
Q1 C1 I 0 0 2N2222
R1 VDD I {RB}
Q2 C2 I 0 0 2N2222
Q3 C3 I 0 0 2N2222
.ends iilg3

.subckt cla2 G1 G0 P1 P0 CI CO
XX1 G1 N001 N002 N003 iilg3
XX2 G0 N002 N001 iilg2
XX3 P1 N003 iilg1
XX4 P0 N002 iilg1
XX5 CI N001 iilg1
XX6 N001 CO iilg1
XX7 N002 CO iilg1
XX8 N003 CO iilg1
* Carry bit 2 generator
.ends cla2

.subckt cla1 CI G P CO
XX1 CI N001 iilg1
XX2 P N002 iilg1
XX3 G N001 N002 iilg2
XX4 N001 CO iilg1
XX5 N002 CO iilg1
* Carry bit 1 generator
.ends cla1

.subckt fag2p2 A B C G_1 G_2 P_1 P_2 S
XX1 A N004 N005 iilg2
XX2 B N004 N008 iilg2
XX7 N002 N001 N003 iilg2
XX9 N003 N009 iilg1
XX10 N007 N009 iilg1
XX11 N009 S iilg1
XX12 N001 S iilg1
XX8 C N001 N007 iilg2
XX3 N005 N006 G_1 G_2 iilg3
XX4 N008 N006 G_1 G_2 iilg3
XX5 N004 N002 P_1 P_2 iilg3
XX6 N006 N002 P_1 P_2 iilg3
* Full Adder
.ends fag2p2

.subckt fag1p1 A B C G P S
XX1 A N003 N005 iilg2
XX2 B N003 N007 iilg2
XX3 N005 N006 G iilg2
XX4 N007 N006 G iilg2
XX5 N003 N002 P iilg2
XX6 N006 N002 P iilg2
XX7 N002 N001 N004 iilg2
XX9 N004 N009 iilg1
XX10 N008 N009 iilg1
XX11 N009 S iilg1
XX12 N001 S iilg1
XX8 C N001 N008 iilg2
* Full Adder
.ends fag1p1

.subckt fag0p0 A B C S
XX1 A N002 N005 iilg2
XX2 B N002 N007 iilg2
XX7 N003 N001 N004 iilg2
XX9 N004 N009 iilg1
XX10 N008 N009 iilg1
XX11 N009 S iilg1
XX12 N001 S iilg1
XX8 C N001 N008 iilg2
XX3 N005 N006 iilg1
XX4 N007 N006 iilg1
XX5 N002 N003 iilg1
XX6 N006 N003 iilg1
* Full Adder
.ends fag0p0

.subckt iilin1 A C1
Q1 C1 N001 0 0 2N2222
R1 A N001 {RB}
.ends iilin1

.model NPN NPN
.model PNP PNP
.lib standard.bjt
.global VDD
.param VDD=5V
.param IB=100u
.param RB={(VDD - 0.65) / IB}
.param t1=10us
.tran {17 * t1}
.backanno
.end